# Altium project 3501.PrjPcb
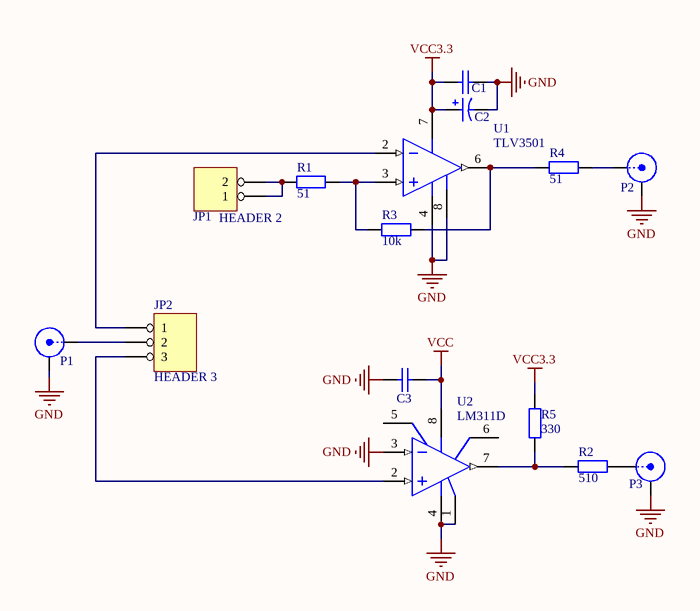
[diagram p0: 3501.SchDoc]
1 sheet, 15 parts. Net scope: global (net labels, ports and power ports of the same name join across sheets).
Board file: 3501.PcbDoc

## Sheet 3501.SchDoc
size A3

### Parts
C1  Cap  [0805C]  (value not drawn)
C2  EC  [1206]  (value not drawn)
C3  Cap  [0805C]  (value not drawn)
JP1  HEADER 2  [header2]
JP2  HEADER 3  [header3]
P1  SMB  [SMB_V-RJ45]  (value not drawn)
P2  SMB  [SMB_V-RJ45]  (value not drawn)
P3  SMB  [SMB_V-RJ45]  (value not drawn)
R1  value 51  [R-0603]  (hidden comment: Res2)
R2  value 510  [R-0603]  (hidden comment: Res2)
R3  value 10k  [R-0603]  (hidden comment: Res2)
R4  value 51  [R-0603]  (hidden comment: Res2)
R5  value 330  [0805R]  (hidden comment: Res2)
U1  TLV3501  [D8]
U2  LM311D  [DIP8]

### Nets
GND: C1.2 C2.2 C3.1 P1.2(Y) P2.2(Y) P3.2(Y) U1.4(V-) U1.8(~{DI}S) U2.1(GND) U2.3(IN-) U2.4(V-)
VCC: C3.2 U2.8(V+)
VCC3.3: C1.1 C2.1 R5.2 U1.7(V+)
NetJP1_1: JP1.1 JP1.2 R1.1
NetJP2_1: JP2.1 U1.2(IN-)
NetJP2_2: JP2.2 P1.1(X)
NetJP2_3: JP2.3 U2.2(IN+)
NetP2_1: P2.1(X) R4.2
NetP3_1: P3.1(X) R2.2
NetR1_2: R1.2 R3.1 U1.3(IN+)
NetR2_1: R2.1 R5.1 U2.7(OUT)
NetR3_2: R3.2 R4.1 U1.6(OUT)

Not connected (* = marked no-connect by the designer): U2 5(BAL) 6(BAL/STB)

### Library data of the parts
C1 C3 = Cap: Capacitor; Published: *; LatestRevisionDate: *; LatestRevisionNote: *; PackageReference: *; Publisher: *; Value: *
C2 = Cap2: Bi-Polar Capacitor; Value: *
P1-P3 = SMB: SMB Straight Connector; LatestRevisionDate: 17-Jul-2002; LatestRevisionNote: Re-released for DXP Platform.; Publisher: Altium Limited
R1-R5 = Res: Resistor; Published: 8-Jun-2000; LatestRevisionDate: 17-Jul-2002; LatestRevisionNote: Re-released for DXP Platform.; PackageReference: AXIAL-0.4; Publisher: Altium Limited
U2 = LM311D: High-Performance Voltage Comparator; Published: 17-Jul-2002; LatestRevisionDate: 13-Apr-2006; LatestRevisionNote: IPC-7351 Footprint Added.; DatasheetVersion: 1988; PackageReference: 751-02; Publisher: Altium Limited; PackageDescription: 8-Pin Small Outline Integrated Circuit 1.27 mm Pitch; Code_JEDEC: MS-012-AA; Code_IPC: SOIC127P600-8; ComponentLink1Description: Manufacturer Link; ComponentLink1URL: http://www.onsemi.com/site/products/taxonomy/0,4438,133,00.html